# EAGLE design GPS_radiologger_v26_ZOE_CMWX_MAX (EAGLE 9.6.2)
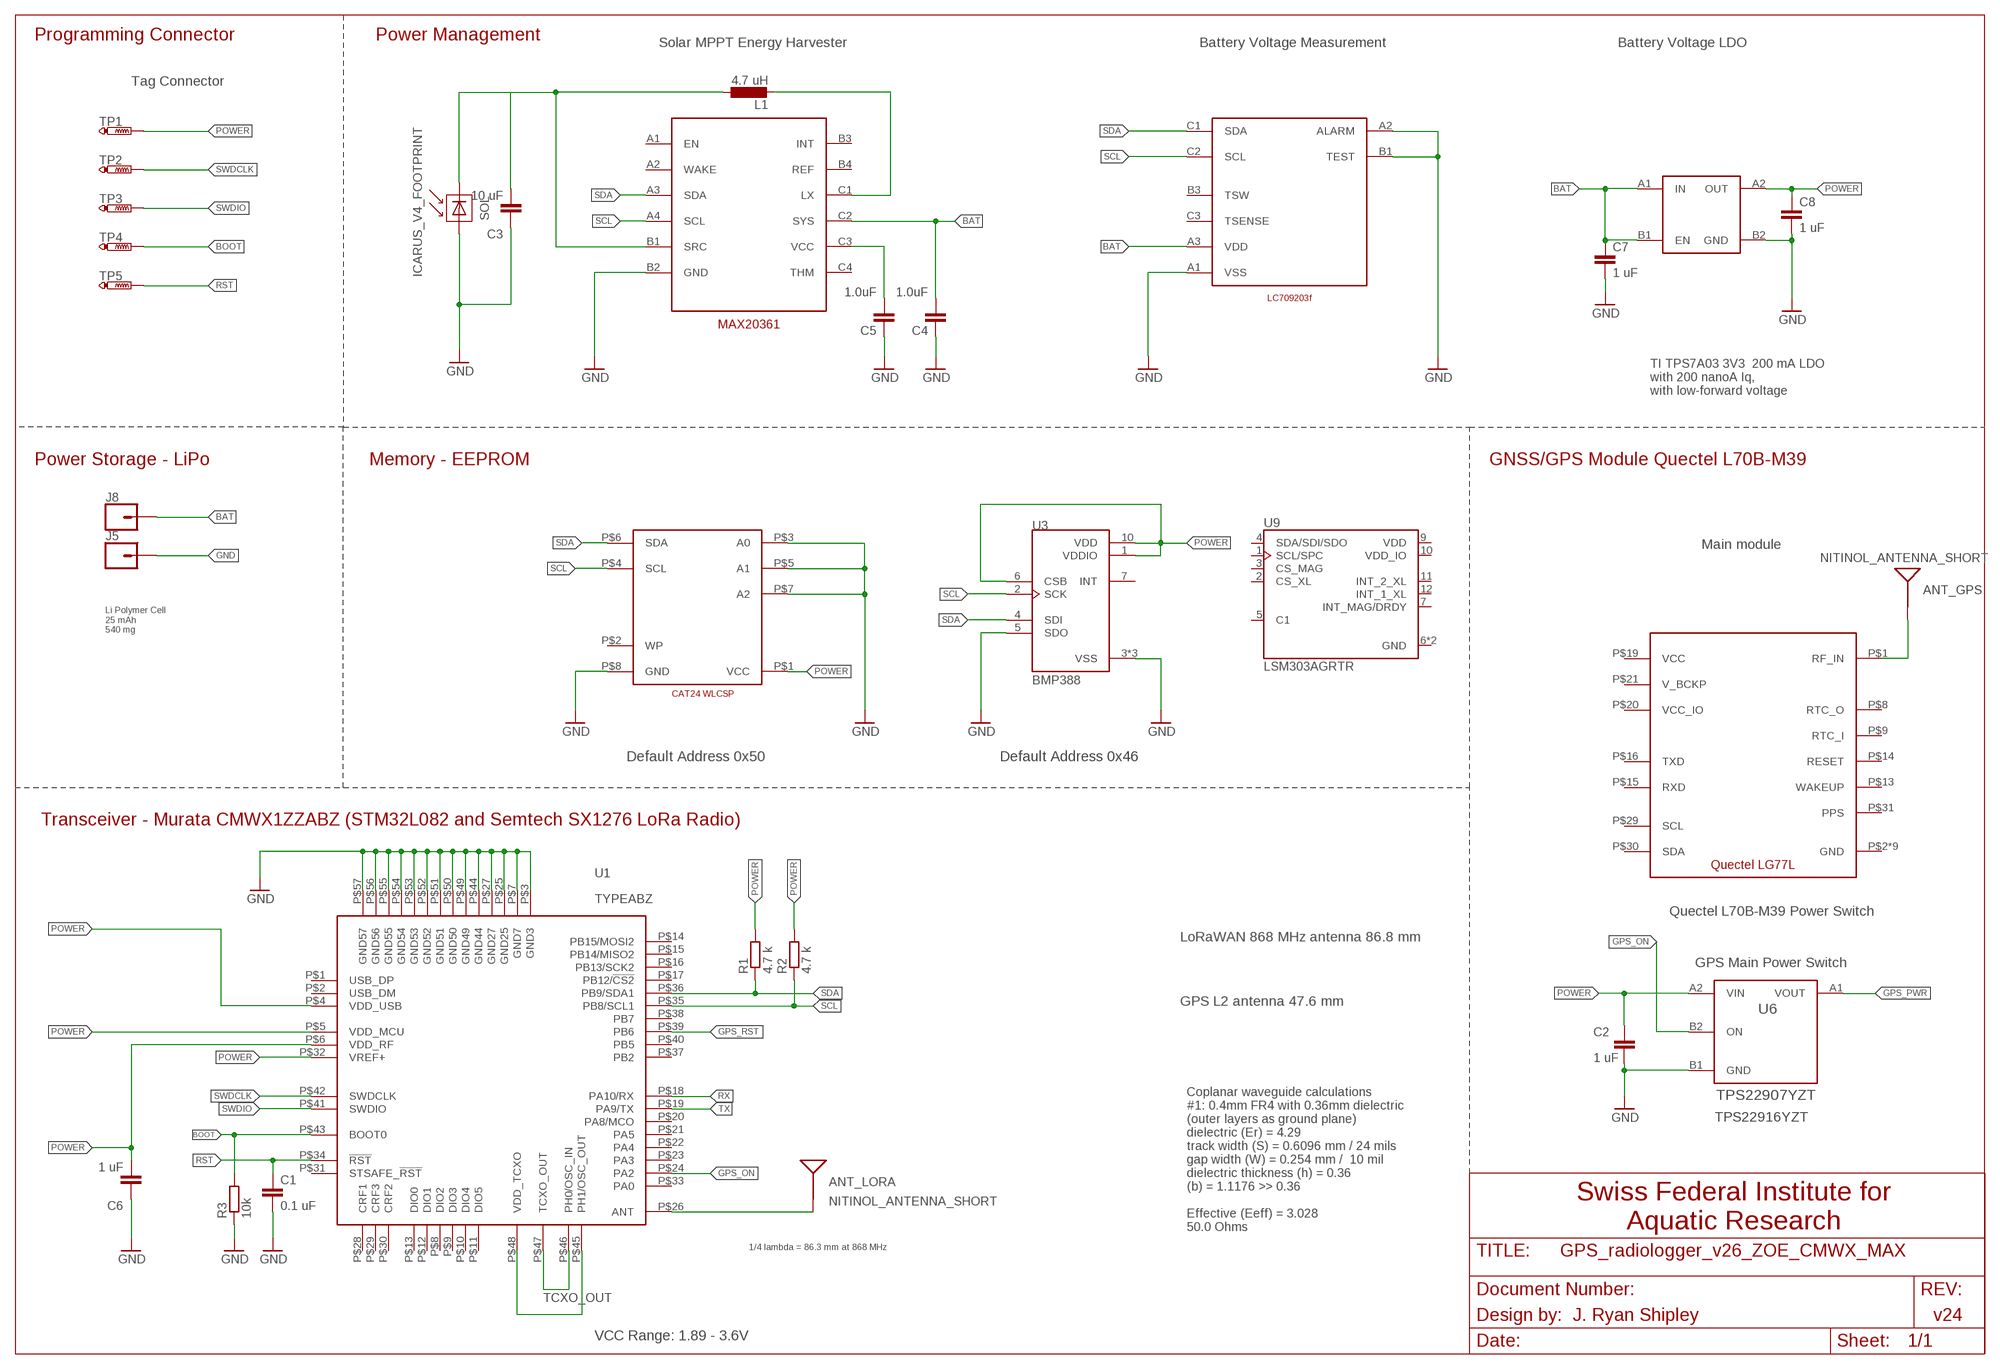
[diagram p0: schematic, sheet 1]

## Parts
ANT_GPS  NITINOL_ANTENNA_SHORT  [ICARUS_NITINOL_ANTENNA_SHORT]
ANT_LORA  NITINOL_ANTENNA_SHORT  [ICARUS_NITINOL_ANTENNA_SHORT]
C1  0.1 uF  C-EUC0201  [C0201]
C2  1 uF  C-EUC0201  [C0201]
C3  10 uF  C-EUC0805K  [C0805K]
C4  1.0uF  1.0UF-0603-16V-10%  [0603]
C5  1.0uF  1.0UF-0603-16V-10%  [0603]
C6  1 uF  C-EUC0201  [C0201]
C7  1 uF  0402CAP.KW  [0402-CAP]
C8  1 uF  0402CAP.KW  [0402-CAP]
J5  CONN_01PTH_NO_SILK_SMALL  [1X01_SMALL]
J8  CONN_01PTH_NO_SILK_SMALL  [1X01_SMALL]
L1  4.7 uH  IND_2016  [INDC2016X120L]
R1  4.7 k  R-EU_R0201  [R0201]
R2  4.7 k  R-EU_R0201  [R0201]
R3  10k  R-EU_R0201  [R0201]
SOL  ICARUS_V4_FOOTPRINT  [ICARUS_FULL_FOOTPRINT]
TP1  PTR1TP08SQ  [TP08SQ]
TP2  PTR1TP08SQ  [TP08SQ]
TP3  PTR1TP08SQ  [TP08SQ]
TP4  PTR1TP08SQ  [TP08SQ]
TP5  PTR1TP08SQ  [TP08SQ]
U1  TYPEABZ  [TYPEABZ]
U3  BMP388  [PQFN50P200X200X80-10N]
U4  TPS7A03-DSBGA  [BGA4N35P2X2_70X70X40N]
U5  LC709203F  [BGA9N50P3X3_160X175X50N]
U6  TPS22907YZT  [YFP0004-DSBGA]
U7  CAT24_WLCSP8  [WLCSP8]
U8  MAX20361  [BGA12N40P4X3_123X163X64N]
U9  LSM303AGRTR  [LGA12R50P_200X200X100]
U$2  LG77L  [LG77L]

## Nets
BAT [battery]: C4.2 C7.1 J8.P$1 U4.A1(IN) U4.B1(EN) U5.A3(VDD) U8.C2(SYS)
BOOT: R3.2 TP4.TP U1.P$43(BOOT0)
GND: C1.2 C2.2 C3.1 C4.1 C5.1 C6.1 C7.2 C8.2 J5.P$1 R3.1 SOL.P$2(MINUS) U1.P$3(GND3) U1.P$7(GND7) U1.P$25(GND25) U1.P$27(GND27) U1.P$44(GND44) U1.P$49(GND49) U1.P$50(GND50) U1.P$51(GND51) U1.P$52(GND52) U1.P$53(GND53) U1.P$54(GND54) U1.P$55(GND55) U1.P$56(GND56) U1.P$57(GND57) U3.3(VSS) U3.5(SDO) U3.8(VSS) U3.9(VSS) U4.B2(GND) U5.A1(VSS) U5.A2(ALARM) U5.B1(TEST) U6.B1(GND) U7.P$3(A0) U7.P$5(A1) U7.P$7(A2) U7.P$8(GND) U8.B2(GND)
GPS_ON: U1.P$24(PA2) U6.B2(ON)
GPS_PWR: U6.A1(VOUT)
GPS_RST: U1.P$39(PB6)
N$1: U1.P$45(PH1/OSC_OUT) U1.P$48(VDD_TCXO)
N$2: ANT_GPS.1(SIGNAL) ANT_GPS.2(SIGNAL) ANT_GPS.3(SIGNAL) U$2.P$1(RF_IN)
N$3: L1.2 U8.C1(LX)
N$4: C5.2 U8.C3(VCC)
N$11 [antenna]: ANT_LORA.1(SIGNAL) ANT_LORA.2(SIGNAL) ANT_LORA.3(SIGNAL) U1.P$26(ANT)
N$15 [battery]: C3.2 L1.1 SOL.P$1(PLUS) U8.B1(SRC)
POWER [power]: C2.1 C6.2 C8.1 R1.2 R2.2 TP1.TP U1.P$4(VDD_USB) U1.P$5(VDD_MCU) U1.P$6(VDD_RF) U1.P$32(VREF+) U3.1(VDDIO) U3.6(CSB) U3.10(VDD) U4.A2(OUT) U6.A2(VIN) U7.P$1(VCC)
RST: C1.1 TP5.TP U1.P$34(!RST)
RX: U1.P$18(PA10/RX)
SCL: R2.1 U1.P$35(PB8/SCL1) U3.2(SCK) U5.C2(SCL) U7.P$4(SCL) U8.A4(SCL)
SDA: R1.1 U1.P$36(PB9/SDA1) U3.4(SDI) U5.C1(SDA) U7.P$6(SDA) U8.A3(SDA)
SWDCLK: TP2.TP U1.P$42(SWDCLK)
SWDIO: TP3.TP U1.P$41(SWDIO)
TCXO_OUT: U1.P$46(PH0/OSC_IN) U1.P$47(TCXO_OUT)
TX: U1.P$19(PA9/TX)
Unconnected: U1.P$1(USB_DP) U1.P$2(USB_DM) U1.P$8(DIO2) U1.P$9(DIO3) U1.P$10(DIO4) U1.P$11(DIO5) U1.P$12(DIO1) U1.P$13(DIO0) U1.P$14(PB15/MOSI2) U1.P$15(PB14/MISO2) U1.P$16(PB13/SCK2) U1.P$17(PB12/!CS2) U1.P$20(PA8/MCO) U1.P$21(PA5) U1.P$22(PA4) U1.P$23(PA3) U1.P$28(CRF1) U1.P$29(CRF3) U1.P$30(CRF2) U1.P$31(STSAFE_!RST) U1.P$33(PA0) U1.P$37(PB2) U1.P$38(PB7) U1.P$40(PB5) U3.7(INT) U5.B3(TSW) U5.C3(TSENSE) U7.P$2(WP) U8.A1(EN) U8.A2(WAKE) U8.B3(INT) U8.B4(REF) U8.C4(THM) U9.1(SCL/SPC) U9.2(CS_XL) U9.3(CS_MAG) U9.4(SDA/SDI/SDO) U9.5(C1) U9.7(INT_MAG/DRDY) U9.11(INT_2_XL) U9.12(INT_1_XL) U$2.P$2(GND) U$2.P$8(RTC_O) U$2.P$9(RTC_I) U$2.P$13(WAKEUP) U$2.P$14(RESET) U$2.P$15(RXD) U$2.P$16(TXD) U$2.P$18(GND) U$2.P$19(VCC) U$2.P$20(VCC_IO) U$2.P$21(V_BCKP) U$2.P$29(SCL) U$2.P$30(SDA) U$2.P$31(PPS) U$2.P$37(GND) U$2.P$38(GND) U$2.P$39(GND) U$2.P$40(GND) U$2.P$41(GND) U$2.P$42(GND) U$2.P$43(GND)

## Notes on the sheet
- Programming Connector | Power Management
- Solar MPPT Energy Harvester | Battery Voltage Measurement | Battery Voltage LDO
- Tag Connector
- TI TPS7A03 3V3  200 mA LDO
  with 200 nanoA Iq, 
  with low-forward voltage
- Power Storage - LiPo | Memory - EEPROM | GNSS/GPS Module Quectel L70B-M39
- Main module
- Li Polymer Cell
  25 mAh
  540 mg
- Default Address 0x50 | Default Address 0x46
- Transceiver - Murata CMWX1ZZABZ (STM32L082 and Semtech SX1276 LoRa Radio)
- Quectel L70B-M39 Power Switch
- LoRaWAN 868 MHz antenna 86.8 mm
- GPS Main Power Switch
- GPS L2 antenna 47.6 mm
- TPS22916YZT
- Swiss Federal Institute for
  Aquatic Research
- Coplanar waveguide calculations
  #1: 0.4mm FR4 with 0.36mm dielectric 
  (outer layers as ground plane)
  dielectric (Er) = 4.29
  track width (S) = 0.6096 mm / 24 mils
  gap width (W) = 0.254 mm /  10 mil
  dielectric thickness (h) = 0.36
  (b) = 1.1176 >> 0.36
  
  Effective (Eeff) = 3.028
  50.0 Ohms
- 1/4 lambda = 86.3 mm at 868 MHz
- Design by: | J. Ryan Shipley | v24
- VCC Range: 1.89 - 3.6V

## Power pins joined to a net without a drawn wire
GND: U9.6(GND) U9.8(GND)
VDD: U9.9(VDD)
VDD_IO: U9.10(VDD_IO)

## Library data of the parts
ANT_GPS ANT_LORA = Antenna_mounts:NITINOL_ANTENNA_SHORT
C1-C3 C6 = rcl:C-EU: CAPACITOR, European symbol; SPICEPREFIX: C
C4 C5 = SparkFun-Capacitors:1.0UF: 1µF ceramic capacitors A capacitor is a passive two-terminal electrical component used to store electrical energy temporarily in an electric field.; PROD_ID: CAP-00868
C7 C8 = SparkFun-Capacitors:0402CAP.KW
J5 J8 = SparkFun-Connectors:CONN_01: Single connection point. Often used as Generic Header-pin footprint for 0.1 inch spaced/style header connections On any of the 0.1 inch spaced packages, you can populate with these: Break Away Headers - Straight <https://www.sparkfun.com/products/116> (PRT-00116) Break Away Male Headers - Right Angle <https://www.sparkfun.com/products/553> (PRT-00553) Female Headers <https://www.sparkfun.com/products/115> (PRT-00115) Break Away Headers - Machine Pin <https://www.sparkfun.com/products/117> (PRT-00117) Break Away Female Headers - Swiss Machine Pin <https://www.sparkfun.com/products/743> (PRT-00743) This device is also useful as a general connection point to wire up your design to another part of your project. Our various solder wires solder well into these plated through hole pads. Hook-Up Wire - Assortment (Stranded, 22 AWG) <https://www.sparkfun.com/products/11375> (PRT-11375) Hook-Up Wire - Assortment (Solid Core, 22 AWG) <https://www.sparkfun.com/products/11367> (PRT-11367) View the entire wire category on our website here <https://www.sparkfun.com/categories/141> Special notes: SMTSO-256-ET is a "flush mount" nut for a 4-40 screw. We mostly use this on specialty testbeds; it is a nice way to connect hardware to your PCB at an adjustable hieght. Also note, the SNAP packages are for using a snappable style connector. We sell a baggie of snaps and they are also used on two LilyPad designs: Snap Assortment - 30 pack (male and female) <https://www.sparkfun.com/products/11347> (DEV-11347) LilyPad Arduino SimpleSnap <https://www.sparkfun.com/products/10941> (DEV-10941) LilyPad SimpleSnap Protoboard <https://www.sparkfun.com/products/10940> (DEV-10940)
L1 = Ryan_custom:IND_2016
R1-R3 = rcl:R-EU_: RESISTOR, European symbol; SPICEPREFIX: R
SOL = TrisolX_Solar_Cells:ICARUS_V4_FOOTPRINT
TP1-TP5 = testpad:PTR1: TEST PIN
U1 = Kris:TYPEABZ: CMWX1ZZABZ-078
U3 = BMP388:BMP388: P-Sensor SPI I2C 1, 25 Bar SMD; AVAILABILITY: Unavailable; DESCRIPTION: Pressure Sensor 4.35PSI ~ 18.13PSI (30kPa ~ 125kPa) Absolute 10-WFLGA; MF: Bosch Sensortec; MP: BMP388; PACKAGE: WFLGA-10 Bosch Tools; PRICE: None
U4 = Ryan_custom:TPS7A03-DSBGA
U5 = Ryan_custom:LC709203F
U6 = TPS22916:TPS22907YZT
U7 = Ryan_custom:CAT24_WLCSP8
U8 = Ryan_custom:MAX20361
U9 = LSM303AGRTR:LSM303AGRTR: Ultra-compact high-performance e-compass 3D accelerometer and 3D magnetometer module Check prices <https://snapeda.com/parts/LSM303AGRTR/STMicroelectronics/view-part/?ref=eda>; AVAILABILITY: Warning; DESCRIPTION: Accelerometer, Magnetometer, Temperature, 6 Axis Sensor I²C, SPI Output; MF: STMicroelectronics; MOUSER-PURCHASE-URL: https://snapeda.com/shop?store=Mouser&id=491952; MP: LSM303AGRTR; PACKAGE: LGA-12 STMicroelectronics; PRICE: None
U$2 = Quectel:LG77L

## Net classes
1 power: width 0.305 mm
2 antenna: width 0.61 mm, clearance 0.254 mm
3 battery: width 0.254 mm
4 diff_pair: width 0.178 mm, clearance 0.152 mm

## Board
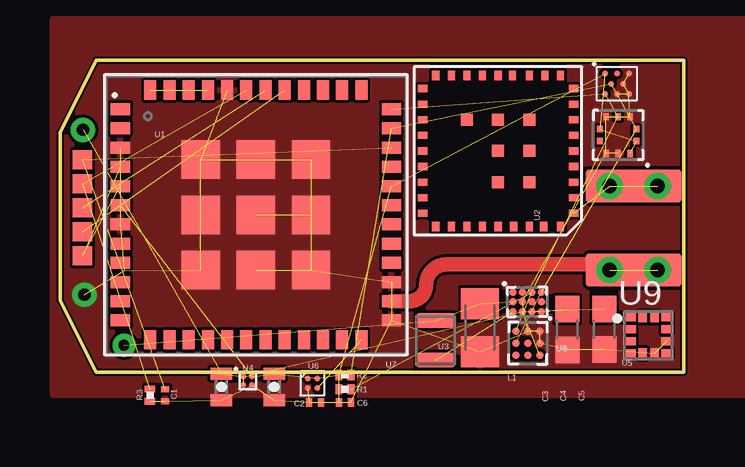
[diagram p1: board, top side]
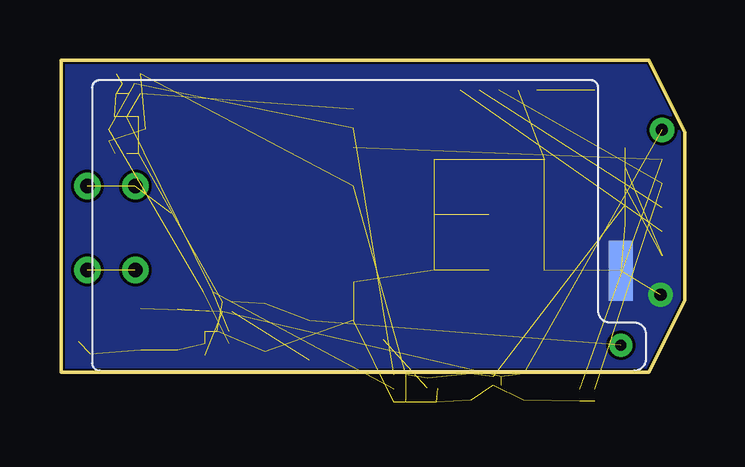
[diagram p2: board, bottom side, seen from below]

Size 26 x 13 mm. Coordinates in mm from the lower left corner, seen from the top.
Outline: 1.5,13 0,10 0,3 1.5,0 26,0 26,13 1.5,13
Copper layers (1*2+15*16): Top 0.035mm / dielectric 0.08mm / Route2 0.035mm / dielectric 0.08mm / Route15 0.035mm / dielectric 0.11mm / Bottom 0.035mm
Design rules "default *": minimum track width 5mil, minimum drill 0.15mm, track to track 5mil, track to pad 3mil, pad to pad 3mil, via to via 3mil, smd to smd 3mil, copper to edge 3mil, drill to drill 3mil, minimum pad ring 10mil, minimum via ring 3mil, stop-mask expansion 0mil, vias tented up to drill 20mil, thermal gap 0mil

### Footprints (pad centres in the part's own frame; a part is rotated, then mirrored left to right if it is on the bottom)
ICARUS_NITINOL_ANTENNA_SHORT = smd 4 x 1.4: 1 0,0 | drill 0.6: 2 -1,0; 3 1,0
C0201 = smd 0.25 x 0.35: 1 -0.25,0; 2 0.25,0
C0805K = smd 1.3 x 1.6: 1 -1,0; 2 1,0
0603 = smd 1.1 x 1: 1 -0.85,0; 2 0.85,0
0402-CAP = smd 0.5 x 0.9: 1 -0.55,0; 2 0.55,0
1X01_SMALL = drill 0.508: P$1 0,0
INDC2016X120L = smd 0.6 x 1.612: 1 -0.825,0; 2 0.825,0
R0201 = smd 0.28 x 0.43: 1 -0.255,0; 2 0.255,0
ICARUS_FULL_FOOTPRINT = drill 0.45: P$1 5,11.5 | smd 2.5 x 1: P$2 1.9,11.5
TP08SQ = smd 0.8 x 0.8: TP 0,0
TYPEABZ = smd 0.8 x 0.5: P$1 -5.65,4.4; P$2 -5.65,3.6; P$3 -5.65,2.8; P$4 -5.65,2; P$5 -5.65,1.2; P$6 -5.65,0.4; P$7 -5.65,-0.4; P$8 -5.65,-1.2; P$9 -5.65,-2; P$10 -5.65,-2.8; P$11 -5.65,-3.6; P$12 -5.65,-4.4; P$25 5.65,-4.4; P$26 5.65,-3.6; P$27 5.65,-2.8; P$28 5.65,-2; P$29 5.65,-1.2; P$30 5.65,-0.4; P$31 5.65,0.4; P$32 5.65,1.2; P$33 5.65,2; P$34 5.65,2.8; P$35 5.65,3.6; P$36 5.65,4.4 | smd 0.5 x 0.8: P$13 -4.4,-5.2; P$14 -3.6,-5.2; P$15 -2.8,-5.2; P$16 -2,-5.2; P$17 -1.2,-5.2; P$18 -0.4,-5.2; P$19 0.4,-5.2; P$20 1.2,-5.2; P$21 2,-5.2; P$22 2.8,-5.2; P$23 3.6,-5.2; P$24 4.4,-5.2; P$37 4.4,5.2; P$38 3.6,5.2; P$39 2.8,5.2; P$40 2,5.2; P$41 1.2,5.2; P$42 0.4,5.2; P$43 -0.4,5.2; P$44 -1.2,5.2; P$45 -2,5.2; P$46 -2.8,5.2; P$47 -3.6,5.2; P$48 -4.4,5.2 | smd 1.6 x 1.6: P$49 -2.3,2.3; P$50 0,2.3; P$51 2.3,2.3; P$52 -2.3,0; P$53 0,0; P$54 2.3,0; P$55 -2.3,-2.3; P$56 0,-2.3; P$57 2.3,-2.3
PQFN50P200X200X80-10N = smd 0.275 x 0.25: 1 -0.765,0.25; 2 -0.765,-0.25; 6 0.765,-0.25; 7 0.765,0.25 | smd 0.25 x 0.275: 3 -0.5,-0.765; 4 0,-0.765; 5 0.5,-0.765; 8 0.5,0.765; 9 0,0.765 | smd 0.255 x 0.275: 10 -0.5,0.765
BGA4N35P2X2_70X70X40N = smd 0.26 x 0.26: A1 -0.175,0.175; A2 0.175,0.175; B1 -0.175,-0.175; B2 0.175,-0.175
BGA9N50P3X3_160X175X50N = smd 0.32 x 0.32: A1 -0.5,0.5; A2 0,0.5; A3 0.5,0.5; B1 -0.5,0; B2 0,0; B3 0.5,0; C1 -0.5,-0.5; C2 0,-0.5; C3 0.5,-0.5
YFP0004-DSBGA = smd 0.25 x 0.25: A1 0.2,-0.2; A2 -0.2,-0.2; B1 0.2,0.2; B2 -0.2,0.2
WLCSP8 = smd 0.24 x 0.24: P$1 -0.5,0.425; P$2 0,0.425; P$3 0.5,0.425; P$4 -0.25,0; P$5 0.25,0; P$6 -0.5,-0.425; P$7 0,-0.425; P$8 0.5,-0.425
BGA12N40P4X3_123X163X64N = smd 0.32 x 0.32: A1 -0.6,0.4; A2 -0.2,0.4; A3 0.2,0.4; A4 0.6,0.4; B1 -0.6,0; B2 -0.2,0; B3 0.2,0; B4 0.6,0; C1 -0.6,-0.4; C2 -0.2,-0.4; C3 0.2,-0.4; C4 0.6,-0.4
LGA12R50P_200X200X100 = smd 0.45 x 0.35: 1 -0.76,0.75; 2 -0.76,0.25; 3 -0.76,-0.25; 4 -0.76,-0.75; 7 0.76,-0.75; 8 0.76,-0.25; 9 0.76,0.25; 10 0.76,0.75 | smd 0.35 x 0.45: 5 -0.25,-0.76; 6 0.25,-0.76; 11 0.25,0.76; 12 -0.25,0.76
LG77L = smd 0.4 x 0.3 bottom: P$1 3.15,2.6; P$2 3.15,1.95; P$3 3.15,1.3; P$4 3.15,0.65; P$5 3.15,0; P$6 3.15,-0.65; P$7 3.15,-1.3; P$8 3.15,-1.95; P$9 3.15,-2.6; P$19 -3.15,-2.6; P$20 -3.15,-1.95; P$21 -3.15,-1.3; P$22 -3.15,-0.65; P$23 -3.15,0; P$24 -3.15,0.65; P$25 -3.15,1.3; P$26 -3.15,1.95; P$27 -3.15,2.6 | smd 0.3 x 0.4 bottom: P$10 2.6,-3.15; P$11 1.95,-3.15; P$12 1.3,-3.15; P$13 0.6,-3.15; P$14 0,-3.15; P$15 -0.65,-3.15; P$16 -1.3,-3.15; P$17 -1.95,-3.15; P$18 -2.6,-3.15; P$28 -2.6,3.15; P$29 -1.95,3.15; P$30 -1.3,3.15; P$31 -0.65,3.15; P$32 0,3.15; P$33 0.65,3.15; P$34 1.3,3.15; P$35 1.9,3.15; P$36 2.6,3.15 | smd 0.5 x 0.5 bottom: P$37 0,0; P$38 0,1.3; P$39 1.3,1.3; P$40 1.3,0; P$41 1.3,-1.3; P$42 0,-1.3; P$43 -1.3,-1.3

### Placement (x,y rotation side)
ANT_GPS  23.92,7.75 180 top
ANT_LORA  23.92,4.25 0 top
C1  4.38,-0.96 270 top
C2  10.63,-1.27 180 top
C3  17.51,1.85 90 top
C4  22.69,1.78 90 top
C5  21.15,1.77 90 top
C6  11.88,-1.27 180 top
C7  6.73,-0.62 270 top
C8  8.93,-0.62 270 top
J5  1.02,3.22 0 top
J8  0.96,10.09 180 top
L1  15.65,1.32 270 top
R1  11.88,-0.72 180 top
R2  11.88,-0.12 180 top
R3  3.75,-0.96 90 top
SOL  14.17,6.11 270 bottom
TP1  0.94,4.84 0 top
TP2  0.94,6.84 0 top
TP3  0.94,5.84 0 top
TP4  0.94,7.84 0 top
TP5  0.94,8.84 0 top
U1  8.17,6.55 0 top
U3  23.27,9.87 180 top
U4  7.83,-0.37 0 top
U5  19.51,1.2 270 top
U6  10.53,-0.47 180 top
U7  23.22,12.01 0 top
U8  19.48,2.92 0 top
U9  24.54,1.53 0 top
U$2  18.27,9.21 180 bottom

### Tracks (layer width: path | path; a pad name or v marks a point on that pad's centre or on a via)
BAT  (6 unrouted)
BOOT  (2 unrouted)
GND  (40 unrouted)
  pour Top: -0.3,14.71 31.71,14.71 31.71,-0.96 -0.3,-0.96
  pour Bottom: -0.71,14.61 32.1,14.61 32.1,-1.83 -0.71,-1.83
GPS_ON  (1 unrouted)
N$1  (1 unrouted)
N$2  (3 unrouted)
N$3  (1 unrouted)
N$4  (1 unrouted)
N$11  (2 unrouted)
  Top 0.61: ANT_LORA.1 23.81,4.48 16.11,4.48 arc90 15.27,3.64 arc-90 14.58,2.95 U1.P$26
N$15  (3 unrouted)
POWER  (15 unrouted)
RST  (2 unrouted)
SCL  (5 unrouted)
SDA  (5 unrouted)
SWDCLK  (1 unrouted)
SWDIO  (1 unrouted)
TCXO_OUT  (1 unrouted)

### Text on the board
tNames: U1 | U2 | U3 | U8 | U5 | C7 | U4 | C8 | U6 | R2 | U7 | L1 | R3 | C1 | C2 | C6 | R1 | C3 | C4 | C5